# Altium schematic sheet A_in_DigiPidCntlr.SchDoc
size A4
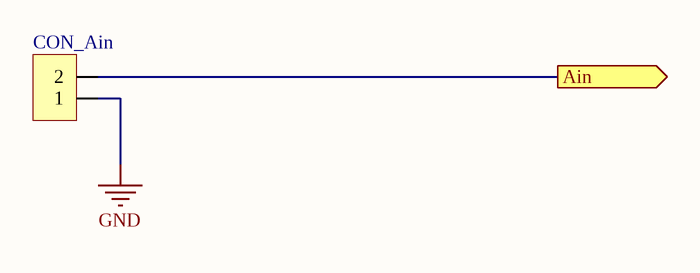
[diagram p0: A_in_DigiPidCntlr.SchDoc]

## Parts
CON_Ain  screw term 2 pin, 5.08mm  [MKDSN 1,5/ 2-5,08]  (value not drawn)

## Ports
Ain (out)

## Nets
GND: CON_Ain.1
Ain: CON_Ain.2 ; port Ain

## Library data of the parts
CON_Ain = 2_pin_5.08mm